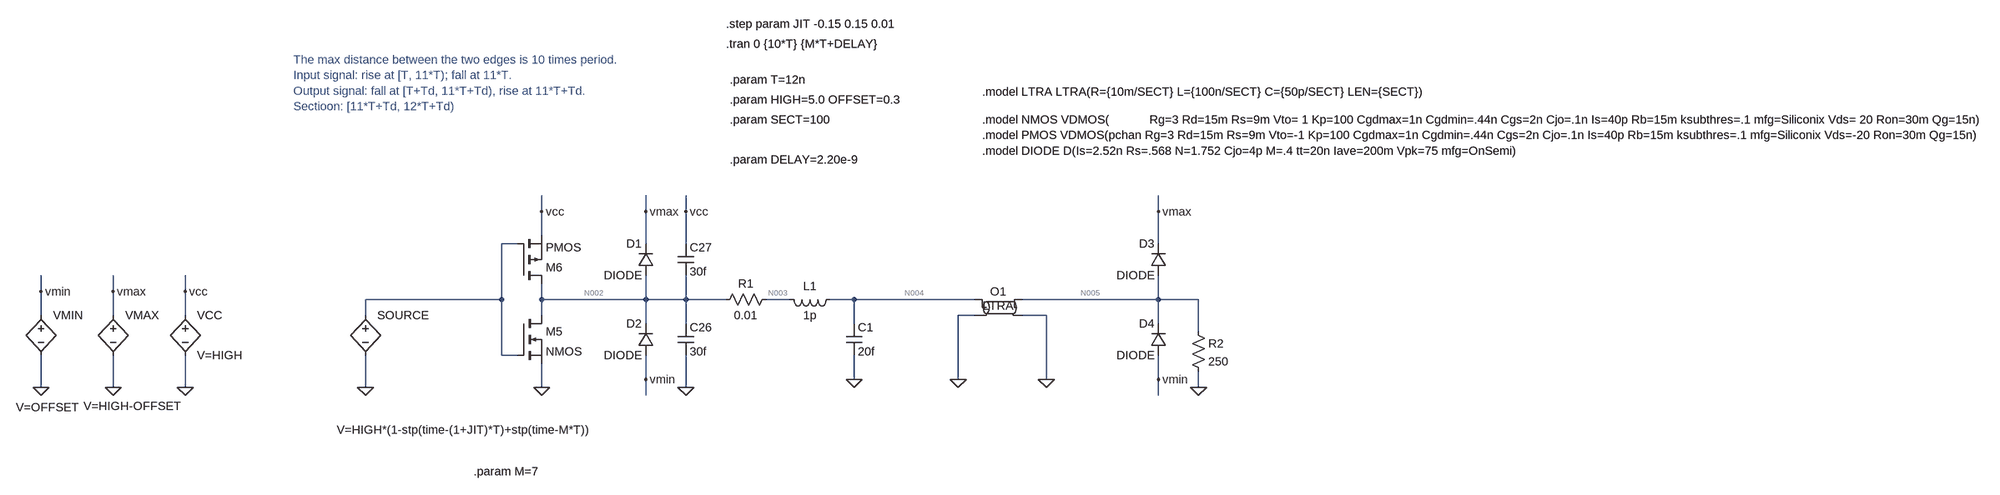
[diagram p0: schematic Test_Sample_Rate.asc]
Test_Sample_Rate.asc, the LTspice schematic file:
Version 4
SHEET 1 5556 2316
WIRE 1200 -112 1200 -144
WIRE 1408 -112 1408 -144
WIRE 1488 -112 1488 -144
WIRE 2432 -112 2432 -144
WIRE 1200 -64 1200 -112
WIRE 1152 -48 1120 -48
WIRE 1408 -48 1408 -112
WIRE 1488 -48 1488 -112
WIRE 2432 -48 2432 -112
WIRE 80 48 80 16
WIRE 224 48 224 16
WIRE 368 48 368 16
WIRE 1120 64 1120 -48
WIRE 1120 64 848 64
WIRE 1200 64 1200 32
WIRE 1408 64 1408 16
WIRE 1408 64 1200 64
WIRE 1488 64 1488 16
WIRE 1488 64 1408 64
WIRE 1568 64 1488 64
WIRE 1696 64 1648 64
WIRE 1824 64 1776 64
WIRE 2064 64 1824 64
WIRE 2432 64 2432 16
WIRE 2432 64 2160 64
WIRE 2512 64 2432 64
WIRE 80 96 80 48
WIRE 224 96 224 48
WIRE 368 96 368 48
WIRE 848 96 848 64
WIRE 1200 96 1200 64
WIRE 2064 96 2032 96
WIRE 2208 96 2160 96
WIRE 1408 112 1408 64
WIRE 1488 112 1488 64
WIRE 1824 112 1824 64
WIRE 2432 112 2432 64
WIRE 2512 128 2512 64
WIRE 1120 176 1120 64
WIRE 1152 176 1120 176
WIRE 1408 224 1408 176
WIRE 1824 224 1824 176
WIRE 2032 224 2032 96
WIRE 2208 224 2208 96
WIRE 2432 224 2432 176
WIRE 80 240 80 176
WIRE 224 240 224 176
WIRE 368 240 368 176
WIRE 848 240 848 176
WIRE 1200 240 1200 192
WIRE 1488 240 1488 176
WIRE 2512 240 2512 208
WIRE 1408 256 1408 224
WIRE 2432 256 2432 224
FLAG 2512 240 0
FLAG 368 240 0
FLAG 368 48 vcc
FLAG 1200 240 0
FLAG 1824 224 0
FLAG 1488 240 0
FLAG 224 240 0
FLAG 224 48 vmax
FLAG 80 240 0
FLAG 80 48 vmin
FLAG 2032 224 0
FLAG 2208 224 0
FLAG 1408 -112 vmax
FLAG 1408 224 vmin
FLAG 1200 -112 vcc
FLAG 1488 -112 vcc
FLAG 848 240 0
FLAG 2432 -112 vmax
FLAG 2432 224 vmin
SYMBOL nmos 1152 96 R0
SYMATTR InstName M5
SYMBOL pmos 1152 32 M180
SYMATTR InstName M6
SYMBOL ind 1792 48 R90
WINDOW 0 5 56 VBottom 2
WINDOW 3 32 56 VTop 2
SYMATTR InstName L1
SYMATTR Value 1p
SYMBOL cap 1808 112 R0
SYMATTR InstName C1
SYMATTR Value 20f
SYMBOL res 1664 48 R90
WINDOW 0 0 56 VBottom 2
WINDOW 3 32 56 VTop 2
SYMATTR InstName R1
SYMATTR Value 0.01
SYMBOL diode 1424 16 R180
WINDOW 0 24 64 Left 2
WINDOW 3 24 0 Left 2
SYMATTR InstName D1
SYMATTR Value DIODE
SYMBOL cap 1472 112 R0
SYMATTR InstName C26
SYMATTR Value 30f
SYMBOL cap 1472 -48 R0
SYMATTR InstName C27
SYMATTR Value 30f
SYMBOL ltline 2112 80 R0
WINDOW 3 0 12 Bottom 2
SYMATTR InstName O1
SYMBOL bv 368 80 R0
SYMATTR InstName VCC
SYMATTR Value V=HIGH
SYMBOL bv 224 80 R0
WINDOW 3 -59 197 Left 2
SYMATTR Value V=HIGH-OFFSET
SYMATTR InstName VMAX
SYMBOL bv 80 80 R0
WINDOW 3 -50 200 Left 2
SYMATTR Value V=OFFSET
SYMATTR InstName VMIN
SYMBOL diode 1424 176 R180
WINDOW 0 24 64 Left 2
WINDOW 3 24 0 Left 2
SYMATTR InstName D2
SYMATTR Value DIODE
SYMBOL res 2496 112 R0
SYMATTR InstName R2
SYMATTR Value 250
SYMBOL bv 848 80 R0
WINDOW 3 -57 245 Left 2
SYMATTR Value V=HIGH*(1-stp(time-(1+JIT)*T)+stp(time-M*T))
SYMATTR InstName SOURCE
SYMBOL diode 2448 16 R180
WINDOW 0 24 64 Left 2
WINDOW 3 24 0 Left 2
SYMATTR InstName D3
SYMATTR Value DIODE
SYMBOL diode 2448 176 R180
WINDOW 0 24 64 Left 2
WINDOW 3 24 0 Left 2
SYMATTR InstName D4
SYMATTR Value DIODE
TEXT 1568 -448 Left 2 !.tran 0 {10*T} {M*T+DELAY}
TEXT 2080 -352 Left 2 !.model LTRA LTRA(R={10m/SECT} L={100n/SECT} C={50p/SECT} LEN={SECT})
TEXT 1576 -376 Left 2 !.param T=12n
TEXT 1576 -336 Left 2 !.param HIGH=5.0 OFFSET=0.3
TEXT 2080 -296 Left 2 !.model NMOS VDMOS(            Rg=3 Rd=15m Rs=9m Vto= 1 Kp=100 Cgdmax=1n Cgdmin=.44n Cgs=2n Cjo=.1n Is=40p Rb=15m ksubthres=.1 mfg=Siliconix Vds= 20 Ron=30m Qg=15n)\n.model PMOS VDMOS(pchan Rg=3 Rd=15m Rs=9m Vto=-1 Kp=100 Cgdmax=1n Cgdmin=.44n Cgs=2n Cjo=.1n Is=40p Rb=15m ksubthres=.1 mfg=Siliconix Vds=-20 Ron=30m Qg=15n)\n.model DIODE D(Is=2.52n Rs=.568 N=1.752 Cjo=4p M=.4 tt=20n Iave=200m Vpk=75 mfg=OnSemi)
TEXT 1576 -296 Left 2 !.param SECT=100
TEXT 1568 -488 Left 2 !.step param JIT -0.15 0.15 0.01
TEXT 1576 -216 Left 2 !.param DELAY=2.20e-9
TEXT 704 -416 Left 2 ;The max distance between the two edges is 10 times period. \nInput signal: rise at [T, 11*T); fall at 11*T. \nOutput signal: fall at [T+Td, 11*T+Td), rise at 11*T+Td. \nSectioon: [11*T+Td, 12*T+Td)
TEXT 1064 408 Left 2 !.param M=7

The netlist it stands for:
* Test_Sample_Rate.asc
M5 N002 N001 0 0 NMOS
M6 N002 N001 vcc vcc PMOS
L1 N004 N003 1p
C1 N004 0 20f
R1 N003 N002 0.01
D1 N002 vmax DIODE
C26 N002 0 30f
C27 vcc N002 30f
O1 N004 0 N005 0 LTRA
B§VCC vcc 0 V=HIGH
B§VMAX vmax 0 V=HIGH-OFFSET
B§VMIN vmin 0 V=OFFSET
D2 vmin N002 DIODE
R2 N005 0 250
B§SOURCE N001 0 V=HIGH*(1-stp(time-(1+JIT)*T)+stp(time-M*T))
D3 N005 vmax DIODE
D4 vmin N005 DIODE
.model D D
.lib standard.dio
.model NMOS NMOS
.model PMOS PMOS
.lib standard.mos
.tran 0 {10*T} {M*T+DELAY}
.model LTRA LTRA(R={10m/SECT} L={100n/SECT} C={50p/SECT} LEN={SECT})
.param T=12n
.param HIGH=5.0 OFFSET=0.3
.model NMOS VDMOS(            Rg=3 Rd=15m Rs=9m Vto= 1 Kp=100 Cgdmax=1n Cgdmin=.44n Cgs=2n Cjo=.1n Is=40p Rb=15m ksubthres=.1 mfg=Siliconix Vds= 20 Ron=30m Qg=15n)
.model PMOS VDMOS(pchan Rg=3 Rd=15m Rs=9m Vto=-1 Kp=100 Cgdmax=1n Cgdmin=.44n Cgs=2n Cjo=.1n Is=40p Rb=15m ksubthres=.1 mfg=Siliconix Vds=-20 Ron=30m Qg=15n)
.model DIODE D(Is=2.52n Rs=.568 N=1.752 Cjo=4p M=.4 tt=20n Iave=200m Vpk=75 mfg=OnSemi)
.param SECT=100
.step param JIT -0.15 0.15 0.01
.param DELAY=2.20e-9
* The max distance between the two edges is 10 times period.
* Input signal: rise at [T, 11*T); fall at 11*T.
* Output signal: fall at [T+Td, 11*T+Td), rise at 11*T+Td.
* Sectioon: [11*T+Td, 12*T+Td)
.param M=7
.backanno
.end

* Results of the author's LTspice run, read from the files saved beside the schematic
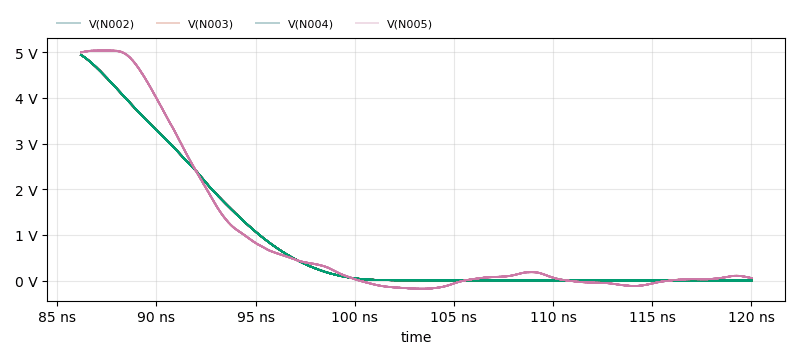
[diagram p1: Transient Analysis of Test_Sample_Rate.asc, plotted from the saved traces]
* Transient Analysis, 31 runs:
*   V(N002) [run 1]: min 654.9 µV, max 4.938 V, average 851.4 mV, rms 1.661 V, last 654.9 µV
*   V(N002) [run 2]: min 655.1 µV, max 4.938 V, average 851.2 mV, rms 1.66 V, last 655.1 µV
*   V(N002) [run 3]: min 655.1 µV, max 4.938 V, average 851.2 mV, rms 1.66 V, last 655.1 µV
*   V(N002) [run 4]: min 655.3 µV, max 4.938 V, average 851.2 mV, rms 1.66 V, last 655.3 µV
*   V(N002) [run 5]: min 655.4 µV, max 4.938 V, average 851.1 mV, rms 1.66 V, last 655.4 µV
*   V(N002) [run 6]: min 655.2 µV, max 4.938 V, average 851.1 mV, rms 1.66 V, last 655.2 µV
*   V(N002) [run 7]: min 655.3 µV, max 4.938 V, average 851.1 mV, rms 1.66 V, last 655.3 µV
*   V(N002) [run 8]: min 655.4 µV, max 4.938 V, average 851.1 mV, rms 1.66 V, last 655.4 µV
*   V(N003) [run 1]: min 658.4 µV, max 4.938 V, average 851.4 mV, rms 1.661 V, last 658.4 µV
*   V(N003) [run 2]: min 658.8 µV, max 4.938 V, average 851.2 mV, rms 1.66 V, last 658.8 µV
*   V(N003) [run 3]: min 658.8 µV, max 4.938 V, average 851.2 mV, rms 1.66 V, last 658.8 µV
*   V(N003) [run 4]: min 658.9 µV, max 4.938 V, average 851.2 mV, rms 1.66 V, last 658.9 µV
*   V(N003) [run 5]: min 659.1 µV, max 4.938 V, average 851.2 mV, rms 1.66 V, last 659.1 µV
*   V(N003) [run 6]: min 658.9 µV, max 4.938 V, average 851.2 mV, rms 1.66 V, last 658.9 µV
*   V(N003) [run 7]: min 659.1 µV, max 4.938 V, average 851.2 mV, rms 1.66 V, last 659.1 µV
*   V(N003) [run 8]: min 659.2 µV, max 4.938 V, average 851.2 mV, rms 1.66 V, last 659.2 µV
*   V(N004) [run 1]: min 658 µV, max 4.938 V, average 851.4 mV, rms 1.661 V, last 658 µV
*   V(N004) [run 2]: min 658.4 µV, max 4.938 V, average 851.2 mV, rms 1.66 V, last 658.4 µV
*   V(N004) [run 3]: min 658.3 µV, max 4.938 V, average 851.2 mV, rms 1.66 V, last 658.3 µV
*   V(N004) [run 4]: min 658.3 µV, max 4.938 V, average 851.2 mV, rms 1.66 V, last 658.3 µV
*   V(N004) [run 5]: min 658.6 µV, max 4.938 V, average 851.2 mV, rms 1.66 V, last 658.6 µV
*   V(N004) [run 6]: min 658.5 µV, max 4.938 V, average 851.2 mV, rms 1.66 V, last 658.5 µV
*   V(N004) [run 7]: min 658.7 µV, max 4.938 V, average 851.2 mV, rms 1.66 V, last 658.7 µV
*   V(N004) [run 8]: min 658.7 µV, max 4.938 V, average 851.2 mV, rms 1.66 V, last 658.7 µV
*   V(N005) [run 1]: min -180.5 mV, max 5.034 V, average 913.4 mV, rms 1.869 V, last 55.91 mV
*   V(N005) [run 2]: min -180.3 mV, max 5.033 V, average 913.2 mV, rms 1.868 V, last 55.78 mV
*   V(N005) [run 3]: min -180.3 mV, max 5.032 V, average 913.1 mV, rms 1.868 V, last 55.68 mV
*   V(N005) [run 4]: min -179.9 mV, max 5.031 V, average 913.1 mV, rms 1.868 V, last 55.66 mV
*   V(N005) [run 5]: min -179.5 mV, max 5.031 V, average 913.1 mV, rms 1.868 V, last 55.54 mV
*   V(N005) [run 6]: min -179.6 mV, max 5.031 V, average 913 mV, rms 1.868 V, last 55.45 mV
*   V(N005) [run 7]: min -179.5 mV, max 5.031 V, average 913 mV, rms 1.868 V, last 55.57 mV
*   V(N005) [run 8]: min -179.5 mV, max 5.032 V, average 913 mV, rms 1.868 V, last 55.41 mV